# EAGLE design deska (EAGLE 9.1.3)
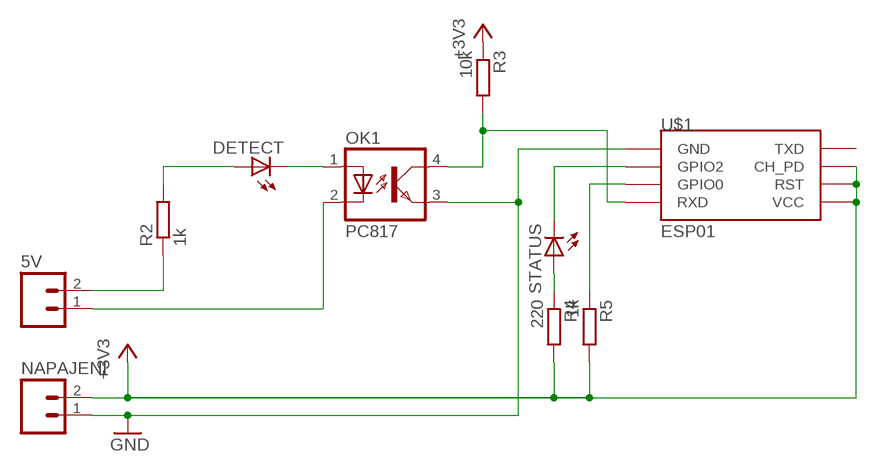
[diagram p0: schematic, sheet 1]

## Parts
5V  M02  [02P]
DETECT  LED3MM  [LED3MM]
NAPAJENI  M02  [02P]
OK1  PC817  [DIL04]
R2  1k  R-EU_0207/7  [0207/7]
R3  10k  R-EU_0207/7  [0207/7]
R4  220  R-EU_0207/7  [0207/7]
R5  1k  R-EU_0207/7  [0207/7]
STATUS  LED3MM  [LED3MM]
U$1  ESP01  [ESP01]

## Nets
+3V3: NAPAJENI.2 R3.1 R4.2 R5.2 U$1.CH_PD U$1.RST U$1.VCC
GND: NAPAJENI.1 OK1.3(EMIT) U$1.GND
N$1: DETECT.A R2.2
N$2: DETECT.K(C) OK1.1(A)
N$3: 5V.2 R2.1
N$5: OK1.4(COL) R3.2 U$1.RX(RXD)
N$6: 5V.1 OK1.2(C)
N$9: STATUS.K(C) U$1.GPIO2
N$10: R5.1 U$1.GPIO0
N$12: R4.1 STATUS.A
Unconnected: U$1.TX(TXD)

## Library data of the parts
5V NAPAJENI = con-amp-quick:M02: AMP QUICK CONNECTOR; OC_FARNELL: unknown; OC_NEWARK: unknown
DETECT STATUS = led:LED: LED OSRAM: - CHIPLED LG R971, LG N971, LY N971, LG Q971, LY Q971, LO R971, LY R971 LH N974, LH R974 LS Q976, LO Q976, LY Q976 LO Q996 - Hyper CHIPLED LW Q18S LB Q993, LB Q99A, LB R99A - SideLED LS A670, LO A670, LY A670, LG A670, LP A670 LB A673, LV A673, LT A673, LW A673 LH A674 LY A675 LS A676, LA A676, LO A676, LY A676, LW A676 LS A679, LY A679, LG A679 - Hyper Micro SIDELED® LS Y876, LA Y876, LO Y876, LY Y876 LT Y87S - SmartLED LW L88C, LW L88S LB L89C, LB L89S, LG L890 LS L89K, LO L89K, LY L89K LS L896, LA L896, LO L896, LY L896 - TOPLED LS T670, LO T670, LY T670, LG T670, LP T670 LSG T670, LSP T670, LSY T670, LOP T670, LYG T670 LG T671, LOG T671, LSG T671 LB T673, LV T673, LT T673, LW T673 LH T674 LS T676, LA T676, LO T676, LY T676, LB T676, LH T676, LSB T676, LW T676 LB T67C, LV T67C, LT T67C, LS T67K, LO T67K, LY T67K, LW E67C LS E67B, LA E67B, LO E67B, LY E67B, LB E67C, LV E67C, LT E67C LW T67C LS T679, LY T679, LG T679 LS T770, LO T770, LY T770, LG T770, LP T770 LB T773, LV T773, LT T773, LW T773 LH T774 LS E675, LA E675, LY E675, LS T675 LS T776, LA T776, LO T776, LY T776, LB T776 LHGB T686 LT T68C, LB T68C - Hyper Mini TOPLED® LB M676 - Mini TOPLED Santana® LG M470 LS M47K, LO M47K, LY M47K Source: http://www.osram.convergy.de LUXEON: - LUMILED® LXK2-PW12-R00, LXK2-PW12-S00, LXK2-PW14-U00, LXK2-PW14-V00 LXK2-PM12-R00, LXK2-PM12-S00, LXK2-PM14-U00 LXK2-PE12-Q00, LXK2-PE12-R00, LXK2-PE12-S00, LXK2-PE14-T00, LXK2-PE14-U00 LXK2-PB12-K00, LXK2-PB12-L00, LXK2-PB12-M00, LXK2-PB14-N00, LXK2-PB14-P00, LXK2-PB14-Q00 LXK2-PR12-L00, LXK2-PR12-M00, LXK2-PR14-Q00, LXK2-PR14-R00 LXK2-PD12-Q00, LXK2-PD12-R00, LXK2-PD12-S00 LXK2-PH12-R00, LXK2-PH12-S00 LXK2-PL12-P00, LXK2-PL12-Q00, LXK2-PL12-R00 Source: www.luxeon.com KINGBRIGHT: KA-3528ASYC Source: www.kingbright.com
OK1 = optocoupler:PC817: SHARP OPTO COUPLER; MPN: PC817X4J000F; OC_FARNELL: 9707727; OC_NEWARK: 97K7059
R2-R5 = resistor:R-EU_: RESISTOR, European symbol
U$1 = esp8266modules:ESP01: ESP8266 Wifi module 01

## Board
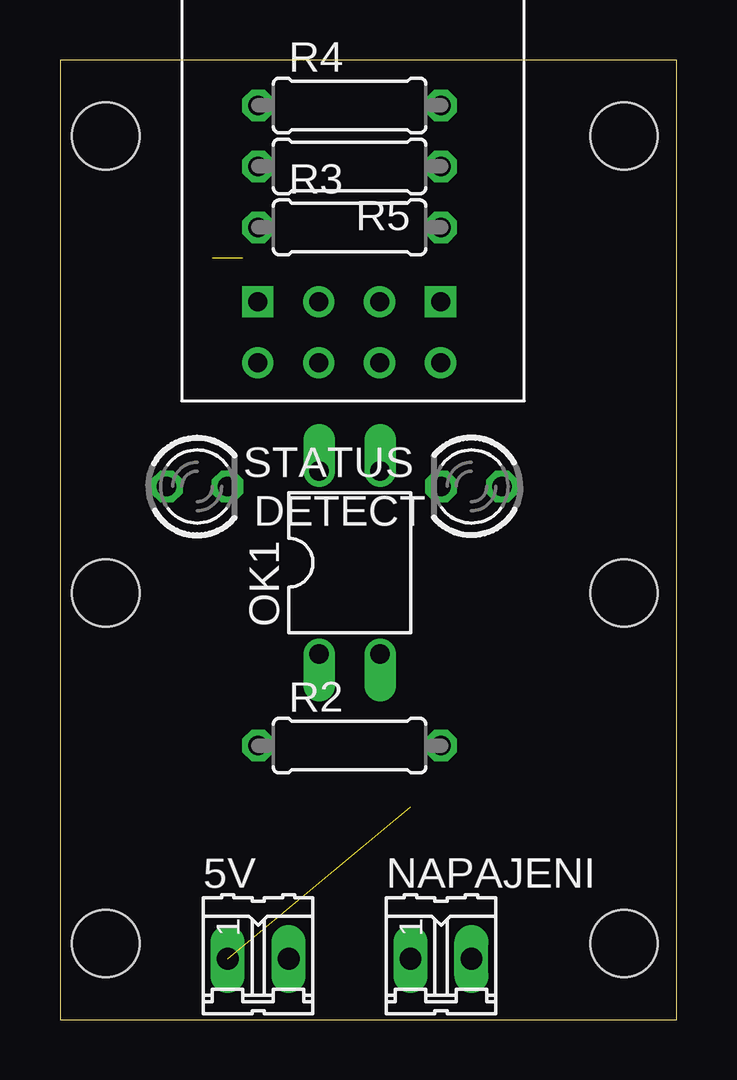
[diagram p1: board, top side]
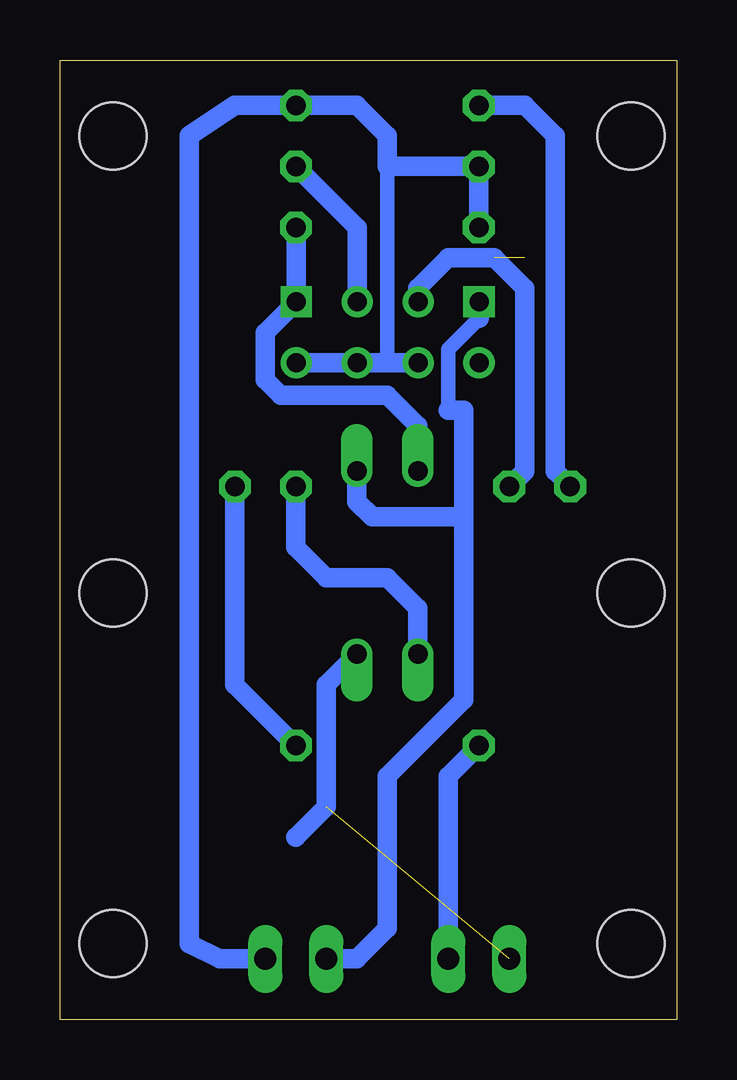
[diagram p2: board, bottom side, seen from below]

Size 25.7 x 39.99 mm. Coordinates in mm from the lower left corner, seen from the top.
Outline: 0,0 25.7,0 25.7,39.99 0,39.99 0,0
Copper layers (1*16): Top 0.035mm / dielectric 1.5mm / Bottom 0.035mm
Design rules "default": minimum track width 10mil, minimum drill 24mil, track to track 8mil, track to pad 8mil, pad to pad 8mil, via to via 8mil, smd to smd 8mil, copper to edge 40mil, drill to drill 8mil, minimum pad ring 10mil, minimum via ring 8mil, stop-mask expansion 4mil, vias tented up to drill 0mil, thermal gap 10mil
Holes 2.8 mm at 1.91,36.83 23.5,36.83 1.91,3.17 23.5,3.17 1.91,17.78 23.5,17.78

### Footprints (pad centres in the part's own frame; a part is rotated, then mirrored left to right if it is on the bottom)
02P = drill 0.914 long: 1 -1.27,0; 2 1.27,0
LED3MM = drill 0.813 octagon: A -1.27,0; K 1.27,0
DIL04 = drill 0.813 offset: 1 -1.27,-3.81; 2 1.27,-3.81; 3 1.27,3.81; 4 -1.27,3.81
0207/7 = drill 0.813 octagon: 1 -3.81,0; 2 3.81,0
ESP01 = drill 0.8: CH_PD -1.285,-8.178; GPIO0 1.255,-5.638; GPIO2 -1.285,-5.638; RST 1.255,-8.178; TX -3.825,-8.178; VCC 3.795,-8.178 | drill 0.8 square: GND -3.825,-5.638; RX 3.795,-5.638

### Placement (x,y rotation side)
5V  8.26,2.54 0 top
DETECT  17.14,22.23 180 top
NAPAJENI  15.88,2.54 0 top
OK1  12.06,19.05 0 top
R2  12.06,11.43 0 top
R3  12.06,33.02 0 top
R4  12.06,38.1 0 top
R5  12.06,35.56 180 top
STATUS  5.71,22.23 0 top
U$1  12.06,35.56 0 top

### Tracks (layer width: path | path; a pad name or v marks a point on that pad's centre or on a via)
+3V3
  Bottom 0.61: 12.06,27.38 12.06,35.56
  Bottom 0.813: U$1.VCC U$1.RST 12.06,27.38 U$1.CH_PD | R3.1 R5.2 12.06,35.56 12.06,36.83 13.34,38.1 R4.2 18.41,38.1 20.32,36.83 20.32,3.17 19.05,2.54 NAPAJENI.2
GND
  Bottom 0.61: 8.24,29.23 9.53,27.94 9.53,25.4
  Bottom 0.813: U$1.GND 8.24,29.23 | NAPAJENI.1 13.34,2.54 12.06,3.81 12.06,10.16 8.89,13.34 8.89,20.95 | OK1.3 13.34,21.59 12.7,20.95 8.89,20.95 | 9.53,25.4 8.89,25.4 8.89,20.95
N$1
  Bottom 0.813: DETECT.A 18.41,13.97 R2.2
N$2
  Bottom 0.813: DETECT.K 15.88,19.68 14.61,18.41 12.06,18.41 10.79,17.14 OK1.1
N$3
  Bottom 0.813: 5V.2 9.53,10.16 R2.1
N$5
  Bottom 0.813: 15.88,29.94 U$1.RX | U$1.RX 15.86,33.01 R3.2 | OK1.4 10.79,24.77 12.06,26.04 16.51,26.04 17.14,26.67 17.14,28.64 U$1.RX
N$6  (1 unrouted)
  Bottom 0.813: 15.88,7.62 14.61,8.89 14.61,13.97 OK1.2
N$9  (1 unrouted)
  Bottom 0.813: U$1.GPIO2 10.79,29.94 10.79,30.48 9.53,31.75 7.62,31.75 6.35,30.48 6.35,22.86 STATUS.K
N$10
  Bottom 0.813: U$1.GPIO0 13.32,33.01 R5.1
N$12
  Bottom 0.813: R4.1 6.35,38.1 5.08,36.83 5.08,22.86 STATUS.A